# Altium schematic sheet Sheet1.SchDoc
size A4
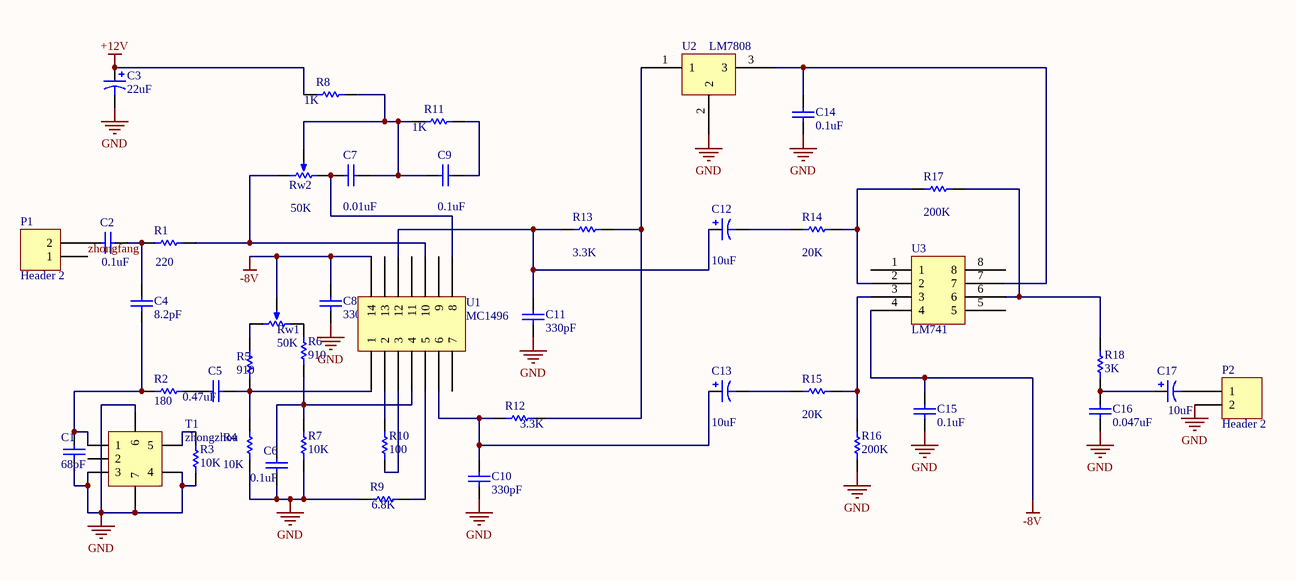
[diagram p0: Sheet1.SchDoc]

## Parts
C1  value 68pF  [2012[0805]]  (hidden comment: Cap)
C2  value 0.1uF  [2012[0805]]  (hidden comment: Cap)
C3  value 22uF  [C1206]  (hidden comment: Cap Pol1)
C4  value 8.2pF  [2012[0805]]  (hidden comment: Cap)
C5  value 0.47uF  [2012[0805]]  (hidden comment: Cap)
C6  value 0.1uF  [2012[0805]]  (hidden comment: Cap)
C7  value 0.01uF  [2012[0805]]  (hidden comment: Cap)
C8  value 330pF  [2012[0805]]  (hidden comment: Cap)
C9  value 0.1uF  [2012[0805]]  (hidden comment: Cap)
C10  value 330pF  [2012[0805]]  (hidden comment: Cap)
C11  value 330pF  [2012[0805]]  (hidden comment: Cap)
C12  value 10uF  [C1206]  (hidden comment: Cap Pol1)
C13  value 10uF  [C1206]  (hidden comment: Cap Pol1)
C14  value 0.1uF  [2012[0805]]  (hidden comment: Cap)
C15  value 0.1uF  [2012[0805]]  (hidden comment: Cap)
C16  value 0.047uF  [2012[0805]]  (hidden comment: Cap)
C17  value 10uF  [C1206]  (hidden comment: Cap Pol1)
P1  Header 2  [HDR1X2]
P2  Header 2  [HDR1X2]
R1  value 220  [2012[0805]]  (hidden comment: Res1)
R2  value 180  [2012[0805]]  (hidden comment: Res1)
R3  value 10K  [2012[0805]]  (hidden comment: Res1)
R4  value 10K  [2012[0805]]  (hidden comment: Res1)
R5  value 910  [2012[0805]]  (hidden comment: Res1)
R6  value 910  [2012[0805]]  (hidden comment: Res1)
R7  value 10K  [2012[0805]]  (hidden comment: Res1)
R8  value 1K  [2012[0805]]  (hidden comment: Res1)
R9  value 6.8K  [2012[0805]]  (hidden comment: Res1)
R10  value 100  [2012[0805]]  (hidden comment: Res1)
R11  value 1K  [2012[0805]]  (hidden comment: Res1)
R12  value 3.3K  [2012[0805]]  (hidden comment: Res1)
R13  value 3.3K  [2012[0805]]  (hidden comment: Res1)
R14  value 20K  [2012[0805]]  (hidden comment: Res1)
R15  value 20K  [2012[0805]]  (hidden comment: Res1)
R16  value 200K  [2012[0805]]  (hidden comment: Res1)
R17  value 200K  [2012[0805]]  (hidden comment: Res1)
R18  value 3K  [2012[0805]]  (hidden comment: Res1)
Rw1  value 50K  [VR5]  (hidden comment: RPot)
Rw2  value 50K  [VR5]  (hidden comment: RPot)
T1  zhongzhou  [zhongzhou]
U1  MC1496  [MC1496]
U2  LM7808  [LM7808]
U3  LM741  [LM741]

## Nets
+12V: C3.1 R8.1
-8V: C8.2 C15.2 Rw1.3(TAP) U1.14 U3.4
GND: C1.1 C3.2 C6.1 C8.1 C10.1 C11.1 C14.1 C15.1 C16.1 P2.2 R3.1 R4.1 R7.1 R9.1 R16.1 T1.3 T1.4 T1.6 T1.7 U2.2
zhongfang: P1.1
NetC1_2: C1.2 C4.1 R2.1 T1.1
NetC2_1: C2.1 P1.2
NetC2_2: C2.2 C4.2 R1.1
NetC5_1: C5.1 R2.2
NetC5_2: C5.2 R4.2 R5.1 U1.1
NetC6_2: C6.2 R6.1 R7.2 U1.4
NetC7_1: C7.1 Rw2.1(TOP) U1.8
NetC7_2: C7.2 C9.1 R8.2 R11.1 Rw2.3(TAP)
NetC9_2: C9.2 R11.2
NetC10_2: C10.2 C13.1 R12.1 U1.6
NetC11_2: C11.2 C12.1 R13.1 U1.12
NetC12_2: C12.2 R14.1
NetC13_2: C13.2 R15.1
NetC14_2: C14.2 U2.3 U3.7
NetC16_2: C16.2 C17.1 R18.1
NetC17_2: C17.2 P2.1
NetR1_2: R1.2 Rw2.2(BOT) U1.10
NetR3_2: R3.2 T1.5
NetR5_2: R5.2 Rw1.2(BOT)
NetR6_2: R6.2 Rw1.1(TOP)
NetR9_2: R9.2 U1.5
NetR10_1: R10.1 U1.3
NetR10_2: R10.2 U1.2
NetR12_2: R12.2 R13.2 U2.1
NetR14_2: R14.2 R17.1 U3.2
NetR15_2: R15.2 R16.2 U3.3
NetR17_2: R17.2 R18.2 U3.6

Not connected (* = marked no-connect by the designer): T1 2; U1 7 9 11 13; U3 1 5 8

## Library data of the parts
C1 C2 C4-C11 C14-C16 = Cap: Capacitor; Published: 8-Jun-2000; LatestRevisionDate: 17-Jul-2002; LatestRevisionNote: Re-released for DXP Platform.; PackageReference: RAD-0.3; Publisher: Altium Limited
C3 C12 C13 C17 = Cap Pol1: Polarized Capacitor (Radial); Published: 8-Jun-2000; LatestRevisionDate: 17-Jul-2002; LatestRevisionNote: Re-released for DXP Platform.; PackageReference: RB7.6-15; Publisher: Altium Limited
P1 P2 = Header 2: Header, 2-Pin; LatestRevisionDate: 17-Jul-2002; LatestRevisionNote: Re-released for DXP Platform.; Publisher: Altium Limited
R1-R18 = Res1: Resistor; Published: 8-Jun-2000; LatestRevisionDate: 17-Jul-2002; LatestRevisionNote: Re-released for DXP Platform.; PackageReference: AXIAL-0.3; Publisher: Altium Limited
Rw1 Rw2 = RPot: Potentiometer; Sim Note: Enter the Resistance value and the set point into parameter fields.; Set Position: 0.5; Published: 8-Jun-2000; LatestRevisionDate: 17-Jul-2002; LatestRevisionNote: Re-released for DXP Platform.; PackageReference: VR5; Publisher: Altium Limited